# EAGLE design IMU_v0_2 (EAGLE 5.10)
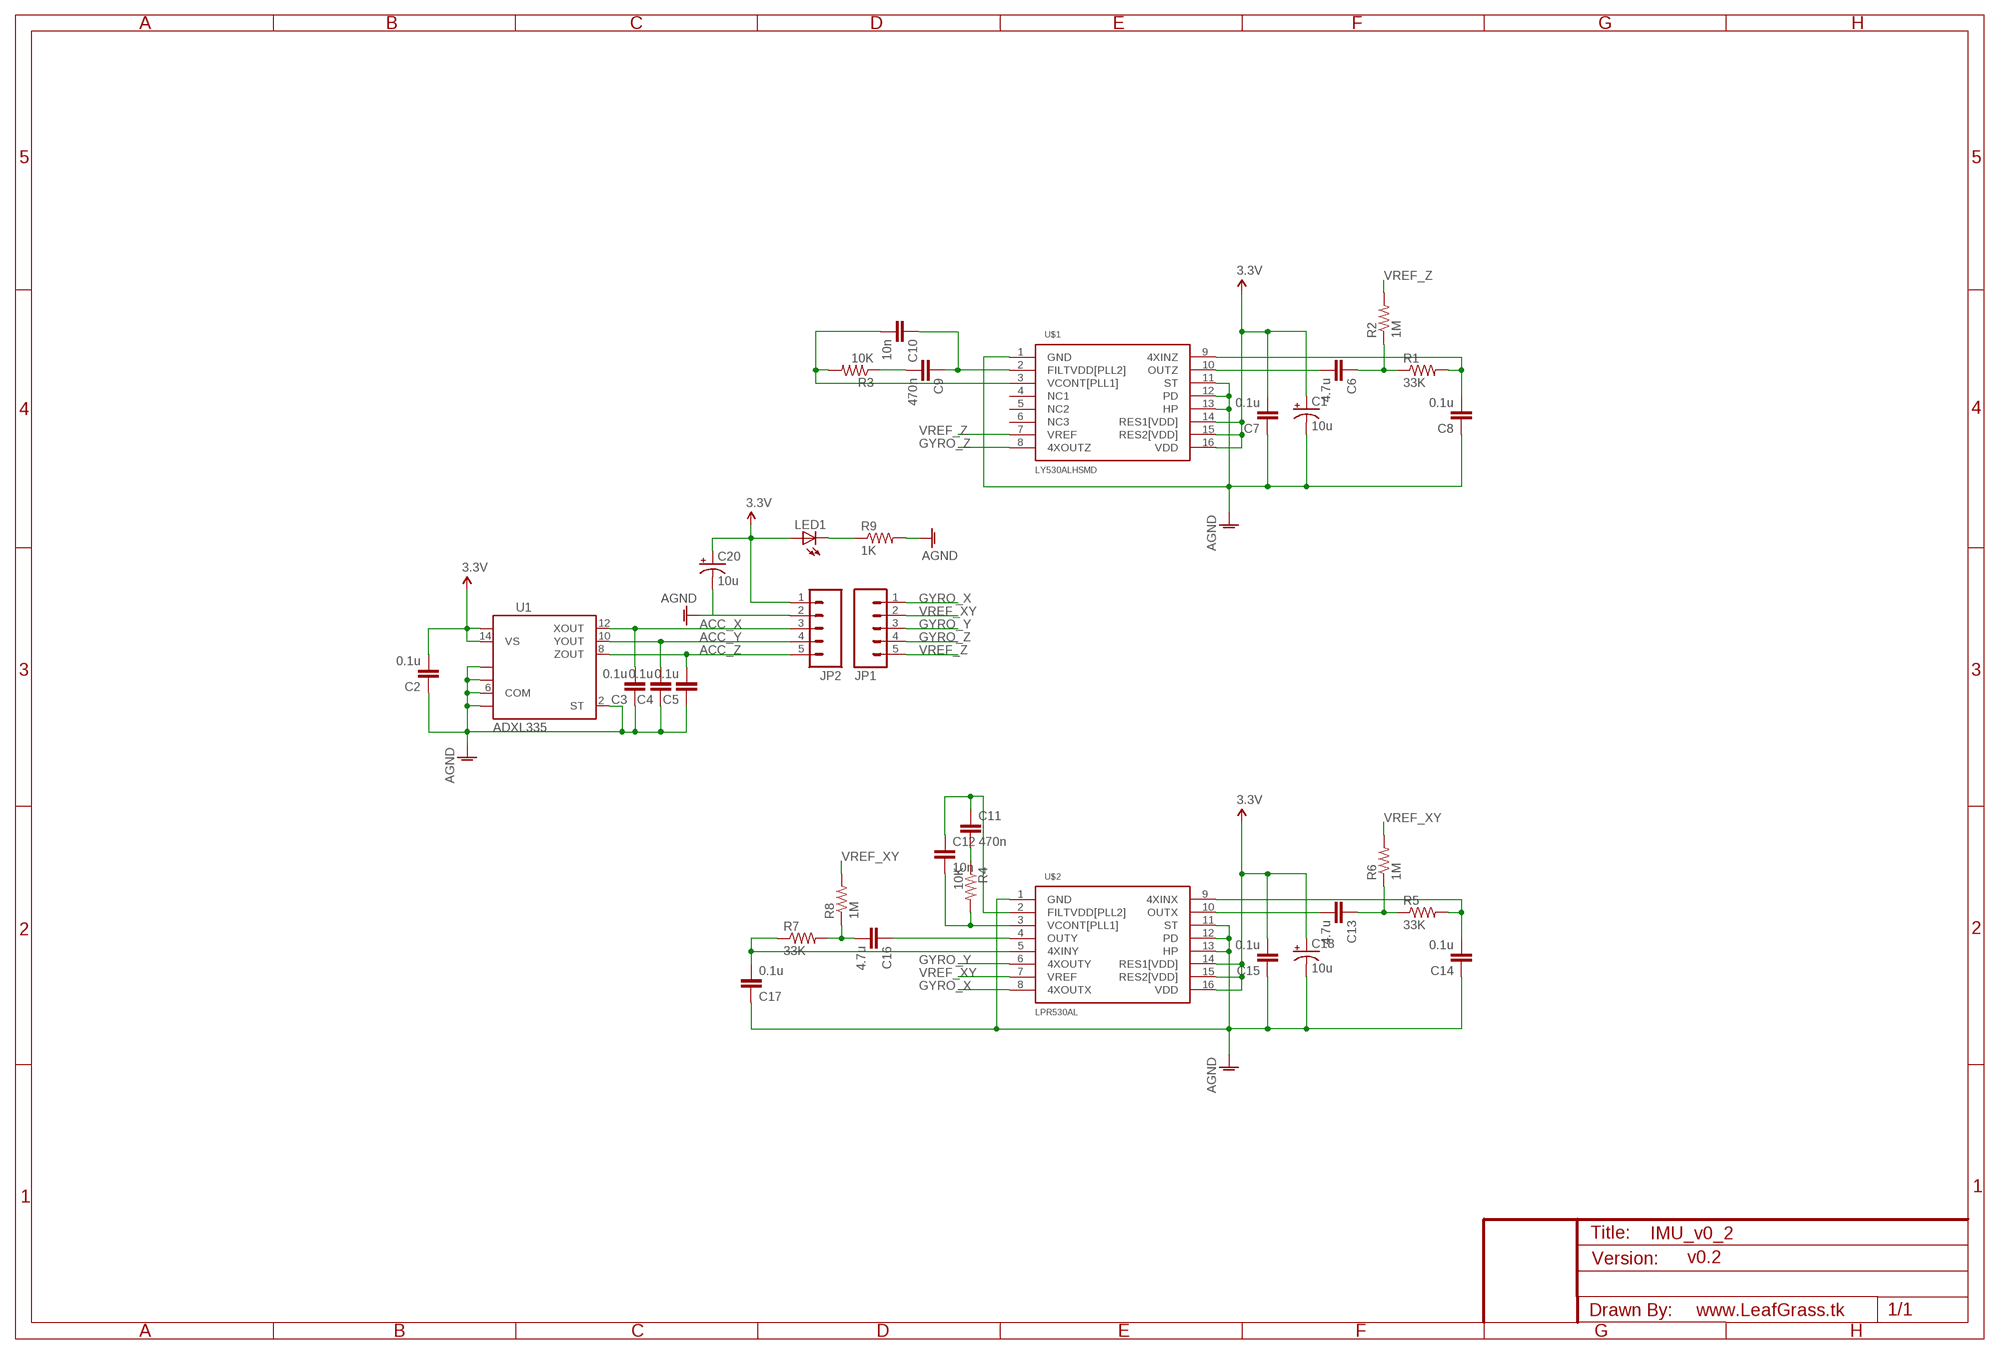
[diagram p0: schematic, sheet 1]

## Parts
C1  10u  CAP_POL1206  [EIA3216]
C2  0.1u  CAP0603-CAP  [0603-CAP]
C3  0.1u  CAP0603-CAP  [0603-CAP]
C4  0.1u  CAP0603-CAP  [0603-CAP]
C5  0.1u  CAP0603-CAP  [0603-CAP]
C6  4.7u  CAP0603-CAP  [0603-CAP]
C7  0.1u  CAP0603-CAP  [0603-CAP]
C8  0.1u  CAP0603-CAP  [0603-CAP]
C9  470n  CAP0603-CAP  [0603-CAP]
C10  10n  CAP0603-CAP  [0603-CAP]
C11  470n  CAP0603-CAP  [0603-CAP]
C12  10n  CAP0603-CAP  [0603-CAP]
C13  4.7u  CAP0603-CAP  [0603-CAP]
C14  0.1u  CAP0603-CAP  [0603-CAP]
C15  0.1u  CAP0603-CAP  [0603-CAP]
C16  4.7u  CAP0603-CAP  [0603-CAP]
C17  0.1u  CAP0603-CAP  [0603-CAP]
C18  10u  CAP_POL1206  [EIA3216]
C20  10u  CAP_POL1206  [EIA3216]
JP1  M05PTH  [1X05]
JP2  M05PTH  [1X05]
LED1  LED0603  [LED-0603]
R1  33K  RESISTOR0603-RES  [0603-RES]
R2  1M  RESISTOR0603-RES  [0603-RES]
R3  10K  RESISTOR0603-RES  [0603-RES]
R4  10K  RESISTOR0603-RES  [0603-RES]
R5  33K  RESISTOR0603-RES  [0603-RES]
R6  1M  RESISTOR0603-RES  [0603-RES]
R7  33K  RESISTOR0603-RES  [0603-RES]
R8  1M  RESISTOR0603-RES  [0603-RES]
R9  1K  RESISTOR0603-RES  [0603-RES]
U1  ADXL335  [LFCSP-16]
U$1  LY530ALHSMD  [LGA16]
U$2  LPR530AL  [LGA16-LPR530ALH]

## Nets
3.3V: C1.A(+) C2.2 C7.2 C15.2 C18.A(+) C20.A(+) JP2.1 LED1.A U1.14(VS) U1.15(VS) U$1.14(RES1[VDD]) U$1.15(RES2[VDD]) U$1.16(VDD) U$2.14(RES1[VDD]) U$2.15(RES2[VDD]) U$2.16(VDD)
ACC_X: C3.2 JP2.3 U1.12(XOUT)
ACC_Y: C4.2 JP2.4 U1.10(YOUT)
ACC_Z: C5.2 JP2.5 U1.8(ZOUT)
AGND: C1.C(-) C2.1 C3.1 C4.1 C5.1 C7.1 C8.1 C14.1 C15.1 C17.1 C18.C(-) C20.C(-) JP2.2 R9.2 U1.2(ST) U1.3(COM) U1.5(COM) U1.6(COM) U1.7(COM) U$1.1(GND) U$1.11(ST) U$1.12(PD) U$1.13(HP) U$2.1(GND) U$2.11(ST) U$2.12(PD) U$2.13(HP)
GYRO_X: JP1.1 U$2.8(4XOUTX)
GYRO_Y: JP1.3 U$2.6(4XOUTY)
GYRO_Z: JP1.4 U$1.8(4XOUTZ)
N$1: C8.2 R1.2 U$1.9(4XINZ)
N$2: LED1.C R9.1
N$3: C6.2 U$1.10(OUTZ)
N$4: C6.1 R1.1 R2.1
N$5: C11.1 C12.1 U$2.2(FILTVDD[PLL2])
N$7: C9.1 C10.1 U$1.2(FILTVDD[PLL2])
N$8: C9.2 R3.1
N$9: C10.2 R3.2 U$1.3(VCONT[PLL1])
N$10: C11.2 R4.1
N$11: C12.2 R4.2 U$2.3(VCONT[PLL1])
N$12: C13.2 U$2.10(OUTX)
N$13: C13.1 R5.1 R6.1
N$14: C14.2 R5.2 U$2.9(4XINX)
N$15: C16.1 U$2.4(OUTY)
N$16: C16.2 R7.2 R8.1
N$17: C17.2 R7.1 U$2.5(4XINY)
VREF_XY: JP1.2 R6.2 R8.2 U$2.7(VREF)
VREF_Z: JP1.5 R2.2 U$1.7(VREF)
Unconnected: U$1.4(NC1) U$1.5(NC2) U$1.6(NC3)

## Notes on the sheet
- v0.2
- www.LeafGrass.tk

## Library data of the parts
C1 C18 C20 = SparkFun:CAP_POL: Capacitor Polarized These are standard SMD and PTH capacitors. Normally 10uF, 47uF, and 100uF in electrolytic and tantalum varieties. Always verify the external diameter of the through hole cap, it varies with capacity, voltage, and manufacturer. The EIA devices should be standard.
C2-C17 = SparkFun:CAP: Capacitor Standard 0603 ceramic capacitor, and 0.1" leaded capacitor.
JP1 JP2 = SparkFun:M05: Header 5 Standard 5-pin 0.1" header. Use with straight break away headers (SKU : PRT-00116), right angle break away headers (PRT-00553), swiss pins (PRT-00743), machine pins (PRT-00117), and female headers (PRT-00115). Molex polarized connector foot print use with SKU : PRT-08230 with associated crimp pins and housings.
LED1 = SparkFun:LED: LEDs Standard schematic elements and footprints for 5mm, 3mm, 1206, and 0603 sized LEDs. 5mm - Spark Fun Electronics SKU : COM-00529 (and others)
R1-R9 = MyLib:RESISTOR: Resistor Basic schematic elements and footprints for 0603, 1206, and PTH 1/10th watt (small) resistors.
U1 = MyLib:ADXL335
U$1 = MyLib:LY530ALH: LY530ALH
U$2 = MyLib:LPR530AL: LPR530AL

## Board
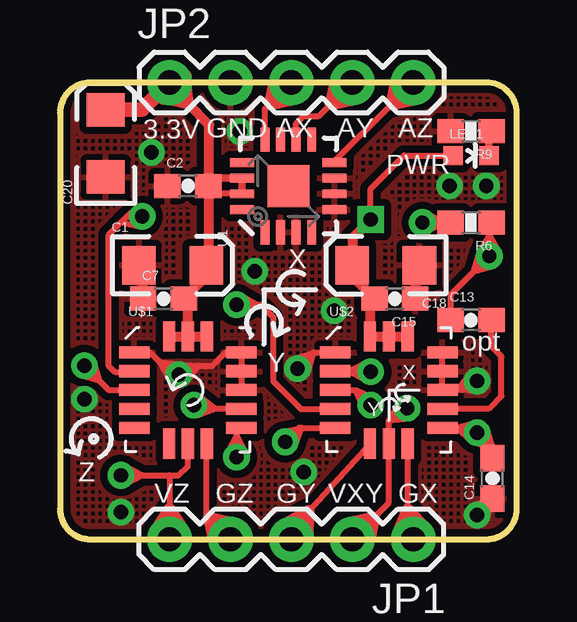
[diagram p1: board, top side]
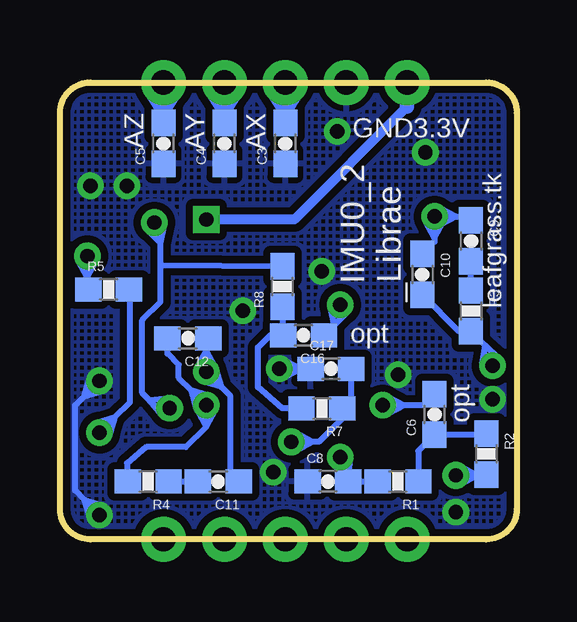
[diagram p2: board, bottom side, seen from below]

Size 19.05 x 19.05 mm. Coordinates in mm from the lower left corner, seen from the top.
Outline: 17.78,0 arc90 19.05,1.27 19.05,17.78 arc90 17.78,19.05 1.27,19.05 arc90 0,17.78 0,1.27 arc90 1.27,0 17.78,0
Copper layers (1*16): Top 0.035mm / dielectric 1.5mm / Bottom 0.035mm
Design rules "SparkFun": minimum track width 8mil, minimum drill 20mil, track to track 8mil, track to pad 8mil, pad to pad 8mil, via to via 8mil, smd to smd 8mil, copper to edge 10mil, drill to drill 8mil, minimum pad ring 12mil, minimum via ring 10mil, stop-mask expansion 4mil, vias tented up to drill 25mil, thermal gap 10mil

### Footprints (pad centres in the part's own frame; a part is rotated, then mirrored left to right if it is on the bottom)
EIA3216 = smd 1.4 x 1.6: A 1.4,0; C -1.4,0
0603-CAP = smd 1.1 x 1: 1 -0.85,0; 2 0.85,0
1X05 = drill 1.016 pad 1.88 round: 1 0,0; 2 2.54,0; 3 5.08,0; 4 7.62,0; 5 10.16,0
LED-0603 = smd 0.8 x 0.8: A 0,-0.75; C 0,0.75
0603-RES = smd 1.1 x 1: 1 -0.85,0; 2 0.85,0
LFCSP-16 = smd 1.75 x 1.75: 0 0,0 | smd 1.006 x 0.37: 1 -1.928,0.975; 2 -1.928,0.325; 3 -1.928,-0.325; 4 -1.928,-0.975; 9 1.928,-0.975; 10 1.928,-0.325; 11 1.928,0.325; 12 1.928,0.975 | smd 0.37 x 1.006: 5 -0.975,-1.928; 6 -0.325,-1.928; 7 0.325,-1.928; 8 0.975,-1.928; 13 0.975,1.928; 14 0.325,1.928; 15 -0.325,1.928; 16 -0.975,1.928
LGA16 = smd 1.27 x 0.508: 1 -2.235,1.575; 2 -2.235,0.787; 3 -2.235,0; 4 -2.235,-0.787; 5 -2.235,-1.575; 9 2.235,-1.575; 10 2.235,-0.787; 11 2.235,0; 12 2.235,0.787; 13 2.235,1.575 | smd 0.508 x 1.27: 6 -0.787,-2.235; 7 0,-2.235; 8 0.787,-2.235; 14 0.787,2.235; 15 0,2.235; 16 -0.787,2.235
LGA16-LPR530ALH = smd 1.27 x 0.508: 1 -2.235,1.575; 2 -2.235,0.787; 3 -2.235,0; 4 -2.235,-0.787; 5 -2.235,-1.575; 9 2.235,-1.575; 10 2.235,-0.787; 11 2.235,0; 12 2.235,0.787; 13 2.235,1.575 | smd 0.508 x 1.27: 6 -0.787,-2.235; 7 0,-2.235; 8 0.787,-2.235; 14 0.787,2.235; 15 0,2.235; 16 -0.787,2.235

### Placement (x,y rotation side)
C1  4.7,11.43 0 top
C2  5.33,14.73 0 top
C3  9.65,16.51 90 bottom
C4  12.19,16.51 90 bottom
C5  14.73,16.51 90 bottom
C6  3.43,5.21 90 bottom
C7  4.32,10.03 0 top
C8  7.87,2.41 0 bottom
C9  1.91,12.45 270 bottom
C10  3.94,11.05 270 bottom
C11  12.45,2.41 180 bottom
C12  13.72,8.38 180 bottom
C13  17.14,9.14 0 top
C14  18.03,2.54 90 top
C15  13.97,10.03 180 top
C16  8.89,8.51 180 bottom
C17  7.75,7.11 0 bottom
C18  13.59,11.43 180 top
C20  1.91,16.51 90 top
JP1  14.73,0 180 top
JP2  4.57,19.05 0 top
LED1  17.14,16 270 top
R1  4.95,2.41 180 bottom
R2  1.27,3.56 270 bottom
R3  1.91,9.53 270 bottom
R4  15.37,2.41 180 bottom
R5  17.02,10.41 0 bottom
R6  17.14,13.21 180 top
R7  8.13,5.46 180 bottom
R8  9.78,10.54 90 bottom
R9  17.14,17.02 180 top
U1  9.53,14.73 90 top
U$1  5.33,6.22 0 top
U$2  13.72,6.22 0 top

### Tracks (layer width: path | path; a pad name or v marks a point on that pad's centre or on a via)
3.3V  (via drill 0.6)
  Top 0.254: U1.15 6.38,14.41 | LED1.A 14.35,16 12.95,14.61 v12.95,13.34
  Top 0.305: 6.22,15.11 6.28,15.06 U1.14 U1.15
  Top 0.406: U$1.15 U$1.14 | U$1.16 U$1.15 | U$2.14 U$2.15 U$2.16 12.93,10.1 C15.2 12.19,10.96 C18.A 12.19,12.57 v12.95,13.34 | 4.57,18.92 5.33,18.16 6.22,17.27 6.22,15.11 6.22,14.86 | U$1.15 5.33,9.74 C7.2 6.1,10.96 C1.A 6.22,11.81 6.22,14.86 | C2.2 6.18,14.82 6.22,14.86
  Top 0.508: 4.32,18.41 5.33,18.16 5.21,19.3
  Top 0.61: 4.57,18.92 JP2.1 | 5.21,19.3 JP2.1 | 4.32,18.41 JP2.1 | C20.A 3.43,17.91 JP2.1
  Bottom 0.406: v12.95,13.34 9.27,13.34 4.57,18.03
  Bottom 0.61: JP2.1 4.57,18.03
ACC_X
  Top 0.254: U1.12 8.55,17.95 8.75,18.15 JP2.3
  Top 0.508: 8.75,18.15 9.8,18.38 JP2.3 8.98,19.2 8.75,18.15
  Bottom 0.254: JP2.3 9.65,17.78 C3.2
  Bottom 0.508: 9.65,17.78 10.23,18.68 JP2.3 9.07,18.68 9.65,17.78
ACC_Y
  Top 0.254: U1.10 9.85,17.34 10.16,17.65 10.79,17.65 11.29,18.15 JP2.4
  Top 0.508: 11.29,18.15 12.34,18.38 JP2.4 11.52,19.2 11.29,18.15
  Bottom 0.254: JP2.4 12.19,17.78 C4.2
  Bottom 0.508: 12.19,17.78 12.77,18.68 JP2.4 11.62,18.68 12.19,17.78
ACC_Z
  Top 0.254: U1.8 11.45,15.77 13.83,18.15 JP2.5
  Top 0.508: 13.83,18.15 14.88,18.38 JP2.5 14.06,19.2 13.83,18.15
  Bottom 0.254: JP2.5 14.73,17.78 C5.2
  Bottom 0.508: 14.73,17.78 15.31,18.68 JP2.5 14.15,18.68 14.73,17.78
AGND  (via drill 0.6)
  Top 0.254: U$1.11 U$1.12 U$1.13 6.91,7.8 6.35,7.24 5.77,7.24 | U$2.13 U$2.12 U$2.11 16.58,6.22 | v9.91,7.11 10.54,7.75 | 10.54,7.75 10.59,7.8 U$2.1 | 16.58,6.22 17.02,6.22 v17.4,6.6 | 4.95,7.24 4.32,7.24 4.2,7.36 | 4.95,7.24 5.77,7.24 | 4.2,7.36 3.76,7.8 U$1.1 | v4.95,6.86 4.95,7.24 | v17.4,1.02 17.4,1.05 18.02,1.67 | 18.02,1.67 C14.1 | 10.54,7.75 9.78,7.52 v9.91,7.11 | 10.54,7.75 10.31,6.99 v9.91,7.11 | 16.58,6.22 17.38,6.18 v17.4,6.6 | 16.58,6.22 17.06,6.86 v17.4,6.6 | 18.02,1.67 17.26,1.42 v17.4,1.02 | 18.02,1.67 17.81,0.91 v17.4,1.02 | 5.77,7.24 4.98,7.28 v4.95,6.86 | 5.77,7.24 5.3,6.6 v4.95,6.86 | 4.2,7.36 4.58,6.66 v4.95,6.86 | 4.2,7.36 4.99,7.28 v4.95,6.86
  Top 0.406: C18.C 14.82,11.77 C15.1 | C7.1 3.47,11.26 C1.C
  Bottom 0.254: C17.1 9.01,7.11 | 9.01,7.11 v9.91,7.11 | 18.04,5.97 18.41,5.59 18.41,2.03 18.04,1.65 | 18.04,5.97 v17.4,6.6 | v17.4,1.02 18.04,1.65 | 9.01,7.11 9.7,6.74 v9.91,7.11 | 9.01,7.11 9.7,7.49 v9.91,7.11 | 18.04,5.97 17.81,6.73 v17.4,6.6 | 18.04,5.97 17.28,6.2 v17.4,6.6 | 18.04,1.65 17.28,1.43 v17.4,1.02 | 18.04,1.65 17.81,0.89 v17.4,1.02
  other vias: 7.49,17.02 16.26,14.73 3.81,16.13 2.54,1.14 10.16,2.79 11.43,9.53 8.13,11.18 1.02,5.84 17.78,14.73
  pour Bottom (isolate 0.305, hatched): 0,1.27 0,17.78 arc-90 1.27,19.05 17.78,19.05 arc-90 19.05,17.78 19.05,1.27 arc-90 17.78,0 1.27,0 arc-90
  pour Top (isolate 0.305, hatched): 0,1.27 0,17.78 arc-90 1.27,19.05 17.78,19.05 arc-90 19.05,17.78 19.05,1.27 arc-90 17.78,0 1.27,0 arc-90
GYRO_X
  Top 0.254: 14.48,3.96 U$2.8 14.5,1.25 14.63,0.48 JP1.1
  Top 0.508: 14.1,0.26 14.5,1.25 15.23,0.47 JP1.1 14.1,0.26
GYRO_Y
  Top 0.254: JP1.3 9.91,0.46 10.38,1.18 U$2.6
  Top 0.508: 9.25,0.56 10.38,1.18 10.32,0 JP1.3 9.25,0.56
GYRO_Z
  Top 0.254: U$1.8 6.12,0.99 6.21,0.9 JP1.4
  Top 0.508: 6.21,0.9 6.44,-0.15 JP1.4 7.26,0.67 6.21,0.9
N$1  (via drill 0.6)
  Top 0.254: 7.49,4.57 U$1.9 7.37,4.45 7.37,4.33 | v7.37,3.43 7.37,4.33 | 7.37,4.33 6.99,3.63 v7.37,3.43 | 7.37,4.33 7.74,3.63 v7.37,3.43
  Bottom 0.254: R1.2 C8.2 7.02,2.6 | 7.02,2.6 7.02,3.09 v7.37,3.43 | 7.02,2.6 7.64,3.1 v7.37,3.43 | 7.02,2.6 6.94,3.38 v7.37,3.43
N$2
  Top 0.305: R9.1 17.89,16.76 LED1.C
N$3  (via drill 0.6)
  Top 0.254: U$1.10 7.54,5.46 6.48,5.46 | v5.59,5.59 5.71,5.46 6.48,5.46 | 6.48,5.46 5.84,5.93 v5.59,5.59 | 6.48,5.46 5.74,5.19 v5.59,5.59
  Bottom 0.254: C6.2 3.94,5.59 4.69,5.59 | 4.69,5.59 v5.59,5.59 | 4.69,5.59 5.38,5.21 v5.59,5.59 | 4.69,5.59 5.38,5.96 v5.59,5.59
N$4
  Bottom 0.254: R1.1 4.1,3.68 C6.1 1.6,4.36 R2.1
N$5  (via drill 0.6)
  Top 0.254: v12.95,6.99 12.93,7.01 12.05,7.01 | 12.05,7.01 U$2.2 | 12.05,7.01 12.74,6.62 v12.95,6.99 | 12.05,7.01 12.76,7.37 v12.95,6.99
  Bottom 0.254: C11.1 11.94,2.63 11.94,5.97 12.32,6.35 | 12.32,6.35 v12.95,6.99 | v12.95,6.99 12.95,7.88 | 12.95,7.88 12.95,8.29 C12.1 | 12.32,6.35 13.08,6.58 v12.95,6.99 | 12.32,6.35 12.54,7.11 v12.95,6.99 | 12.95,7.88 12.58,7.19 v12.95,6.99 | 12.95,7.88 13.33,7.19 v12.95,6.99
N$7  (via drill 0.6)
  Top 0.254: U$1.2 3.07,6.99 2.29,6.99 2.03,7.24 2.03,12.7 2.56,13.23 | 2.56,13.23 2.79,13.46 v3.43,13.46 | 2.56,13.23 3.33,13.05 v3.43,13.46 | 2.56,13.23 3.13,13.77 v3.43,13.46
  Bottom 0.254: C9.1 2.07,13.46 2.53,13.46 | v3.43,13.46 2.53,13.46 | C10.1 3.43,12.41 3.43,12.56 | v3.43,13.46 3.43,12.56 | 2.53,13.46 3.23,13.09 v3.43,13.46 | 2.53,13.46 3.23,13.84 v3.43,13.46 | 3.43,12.56 3.81,13.26 v3.43,13.46 | 3.43,12.56 3.05,13.26 v3.43,13.46
N$8
  Bottom 0.254: R3.1 C9.2
N$9  (via drill 0.6)
  Top 0.254: v1.02,7.24 1.65,6.6 | 1.65,6.6 2.03,6.22 U$1.3 | 1.65,6.6 1.43,7.36 v1.02,7.24 | 1.65,6.6 0.89,6.83 v1.02,7.24
  Bottom 0.254: v1.02,7.24 1.02,7.79 1.32,8.09 | 1.32,8.09 R3.2 2.41,8.68 C10.2 | 1.32,8.09 0.73,7.56 v1.02,7.24 | 1.32,8.09 1.44,7.3 v1.02,7.24
N$10
  Bottom 0.254: R4.1 C11.2
N$11  (via drill 0.6)
  Top 0.254: U$2.3 12.32,6.22 | 12.32,6.22 v12.95,5.59 | 12.32,6.22 12.67,5.46 v12.95,5.59 | 12.32,6.22 13.08,5.87 v12.95,5.59
  Bottom 0.254: 14.48,8.05 14.44,8.09 C12.2 14.57,7.75 14.1,7.28 14.1,6.73 13.59,6.22 | R4.2 16.26,2.45 16.26,3.17 15.46,3.85 13.8,3.85 12.96,4.69 | v12.95,5.59 13.59,6.22 | 12.96,4.69 12.95,4.7 v12.95,5.59 | 13.59,6.22 12.83,6 v12.95,5.59 | 13.59,6.22 13.36,5.46 v12.95,5.59 | 12.96,4.69 13.33,5.39 v12.95,5.59 | 12.96,4.69 12.58,5.38 v12.95,5.59
N$12
  Top 0.254: U$2.10 15.98,5.46 17.91,5.46 18.41,5.97 18.41,7.62 18,8.04 C13.2
N$13  (via drill 0.6)
  Top 0.254: C13.1 16.3,10.2 17.27,11.18 | 17.27,11.18 v17.91,11.81 | R6.1 17.91,13.17 17.91,12.71 | v17.91,11.81 17.91,12.71 | 17.27,11.18 18.03,11.4 v17.91,11.81 | 17.27,11.18 17.5,11.93 v17.91,11.81 | 17.91,12.71 17.53,12.01 v17.91,11.81 | 17.91,12.71 18.28,12.01 v17.91,11.81
  Bottom 0.254: 18.03,10.76 17.78,10.5 R5.1 17.91,10.45 17.91,10.91 | v17.91,11.81 17.91,10.91 | 17.91,10.91 18.28,11.61 v17.91,11.81 | 17.91,10.91 17.53,11.61 v17.91,11.81
N$14  (via drill 0.6)
  Top 0.254: v17.4,4.45 18.03,3.81 | 18.03,3.81 C14.2 | U$2.9 16.52,4.65 | 16.52,4.65 17.2,4.65 v17.4,4.45 | 18.03,3.81 17.81,4.57 v17.4,4.45 | 18.03,3.81 17.28,4.04 v17.4,4.45 | 16.52,4.65 17.12,4.12 v17.4,4.45 | 16.52,4.65 17.29,4.86 v17.4,4.45
  Bottom 0.254: v17.4,4.45 16.76,5.08 | 16.76,5.08 16.13,5.71 16.13,10.38 R5.2 | 16.76,5.08 16.99,4.32 v17.4,4.45 | 16.76,5.08 17.52,4.85 v17.4,4.45
N$15  (via drill 0.6)
  Top 0.254: U$2.4 10.06,5.44 8.89,6.6 8.89,9.27 8.38,9.78 8.27,9.78 | v7.37,9.78 8.27,9.78 | 8.27,9.78 7.57,10.15 v7.37,9.78 | 8.27,9.78 7.57,9.4 v7.37,9.78
  Bottom 0.254: v7.37,9.78 7.53,9.78 | 7.63,8.92 7.37,9.18 v7.37,9.78 | 7.63,8.92 C16.1 | 7.63,8.92 7.79,9.7 v7.37,9.78 | 7.63,8.92 7.07,9.47 v7.37,9.78
N$16
  Bottom 0.254: R7.2 9.78,5.46 10.79,6.35 10.79,8 10.29,8.51 C16.2 | C16.2 9.74,8.8 9.49,8.8 9.4,8.89 | R8.1 9.74,9.69 C16.2
N$17  (via drill 0.6)
  Top 0.254: v9.4,4.06 9.98,4.65 10.08,4.65 | 10.08,4.65 U$2.5 | 10.08,4.65 9.31,4.48 v9.4,4.06 | 10.08,4.65 9.8,3.91 v9.4,4.06
  Bottom 0.254: 8.5,4.06 8.26,4.06 7.28,5.04 R7.1 6.9,5.84 C17.2 | 8.5,4.06 v9.4,4.06 | 8.5,4.06 9.2,3.69 v9.4,4.06 | 8.5,4.06 9.2,4.44 v9.4,4.06
VREF_XY  (via drill 0.6)
  Top 0.254: 13.71,4.95 13.72,4.7 U$2.7 13.72,1.52 13.09,0.9 JP1.2 | 13.71,4.95 v14.48,5.46 | v15.11,13.21 16.01,13.21 | 16.01,13.21 R6.2 | 13.71,4.95 14.6,5.05 v14.48,5.46 | 13.71,4.95 14.2,5.71 v14.48,5.46 | 16.01,13.21 15.32,13.58 v15.11,13.21 | 16.01,13.21 15.32,12.83 v15.11,13.21
  Top 0.508: 13.09,0.9 12.05,0.67 JP1.2 12.86,-0.15 13.09,0.9
  Bottom 0.254: v14.48,5.46 14.99,5.46 15.32,5.79 | 15.32,5.79 15.62,6.1 15.62,9.14 14.86,9.91 14.86,11.43 | 14.86,11.43 14.86,12.35 | 14.86,12.35 14.86,12.95 v15.11,13.21 | 15.32,5.79 14.53,5.88 v14.48,5.46 | 15.32,5.79 14.8,5.18 v14.48,5.46 | 14.86,12.35 15.42,12.91 v15.11,13.21 | 14.86,12.35 14.7,13.12 v15.11,13.21 | 14.86,11.43 R8.2
VREF_Z  (via drill 0.6)
  Top 0.254: 4.57,2.67 4.95,2.67 5.33,3.05 U$1.7 | JP1.5 4.57,1.27 4.57,2.67 | 3.44,2.67 4.57,2.67 | v2.54,2.67 3.44,2.67 | 3.44,2.67 2.74,3.04 v2.54,2.67 | 3.44,2.67 2.74,2.29 v2.54,2.67
  Top 0.508: 4.57,1.27 4,0.37 JP1.5 5.15,0.37 4.57,1.27
  Bottom 0.254: 1.64,2.67 v2.54,2.67 | 1.64,2.67 1.31,2.67 R2.2 | 1.64,2.67 2.34,2.29 v2.54,2.67 | 1.64,2.67 2.34,3.04 v2.54,2.67

### Text on the board
tPlace: 3.3V | GND | AX | AY | AZ | PWR | X | opt | Y | Z | VZ | GZ | GY | VXY | GX
bPlace: AX | AY | AZ | 3.3V | GND | IMU0_2 | leafgrass.tk | _Librae | opt | opt